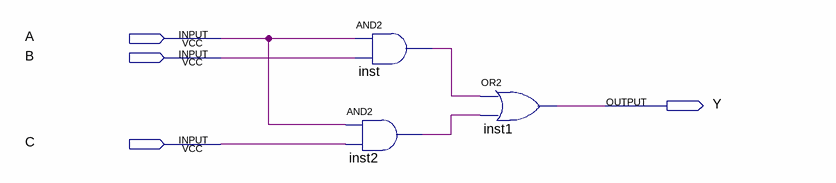
[diagram p0: schematic sheet]
// Quartus schematic Headlight.bdf as structural Verilog: 3 symbols, 4 pins
module Headlight (
  input  A,
  input  B,
  input  C,
  output Y
);

  wire inst2_out, inst_out;

  and inst2 (inst2_out, A, C);
  and inst (inst_out, A, B);
  or inst1 (Y, inst_out, inst2_out);
endmodule
